# Altium project CP17E0276.PrjPcb
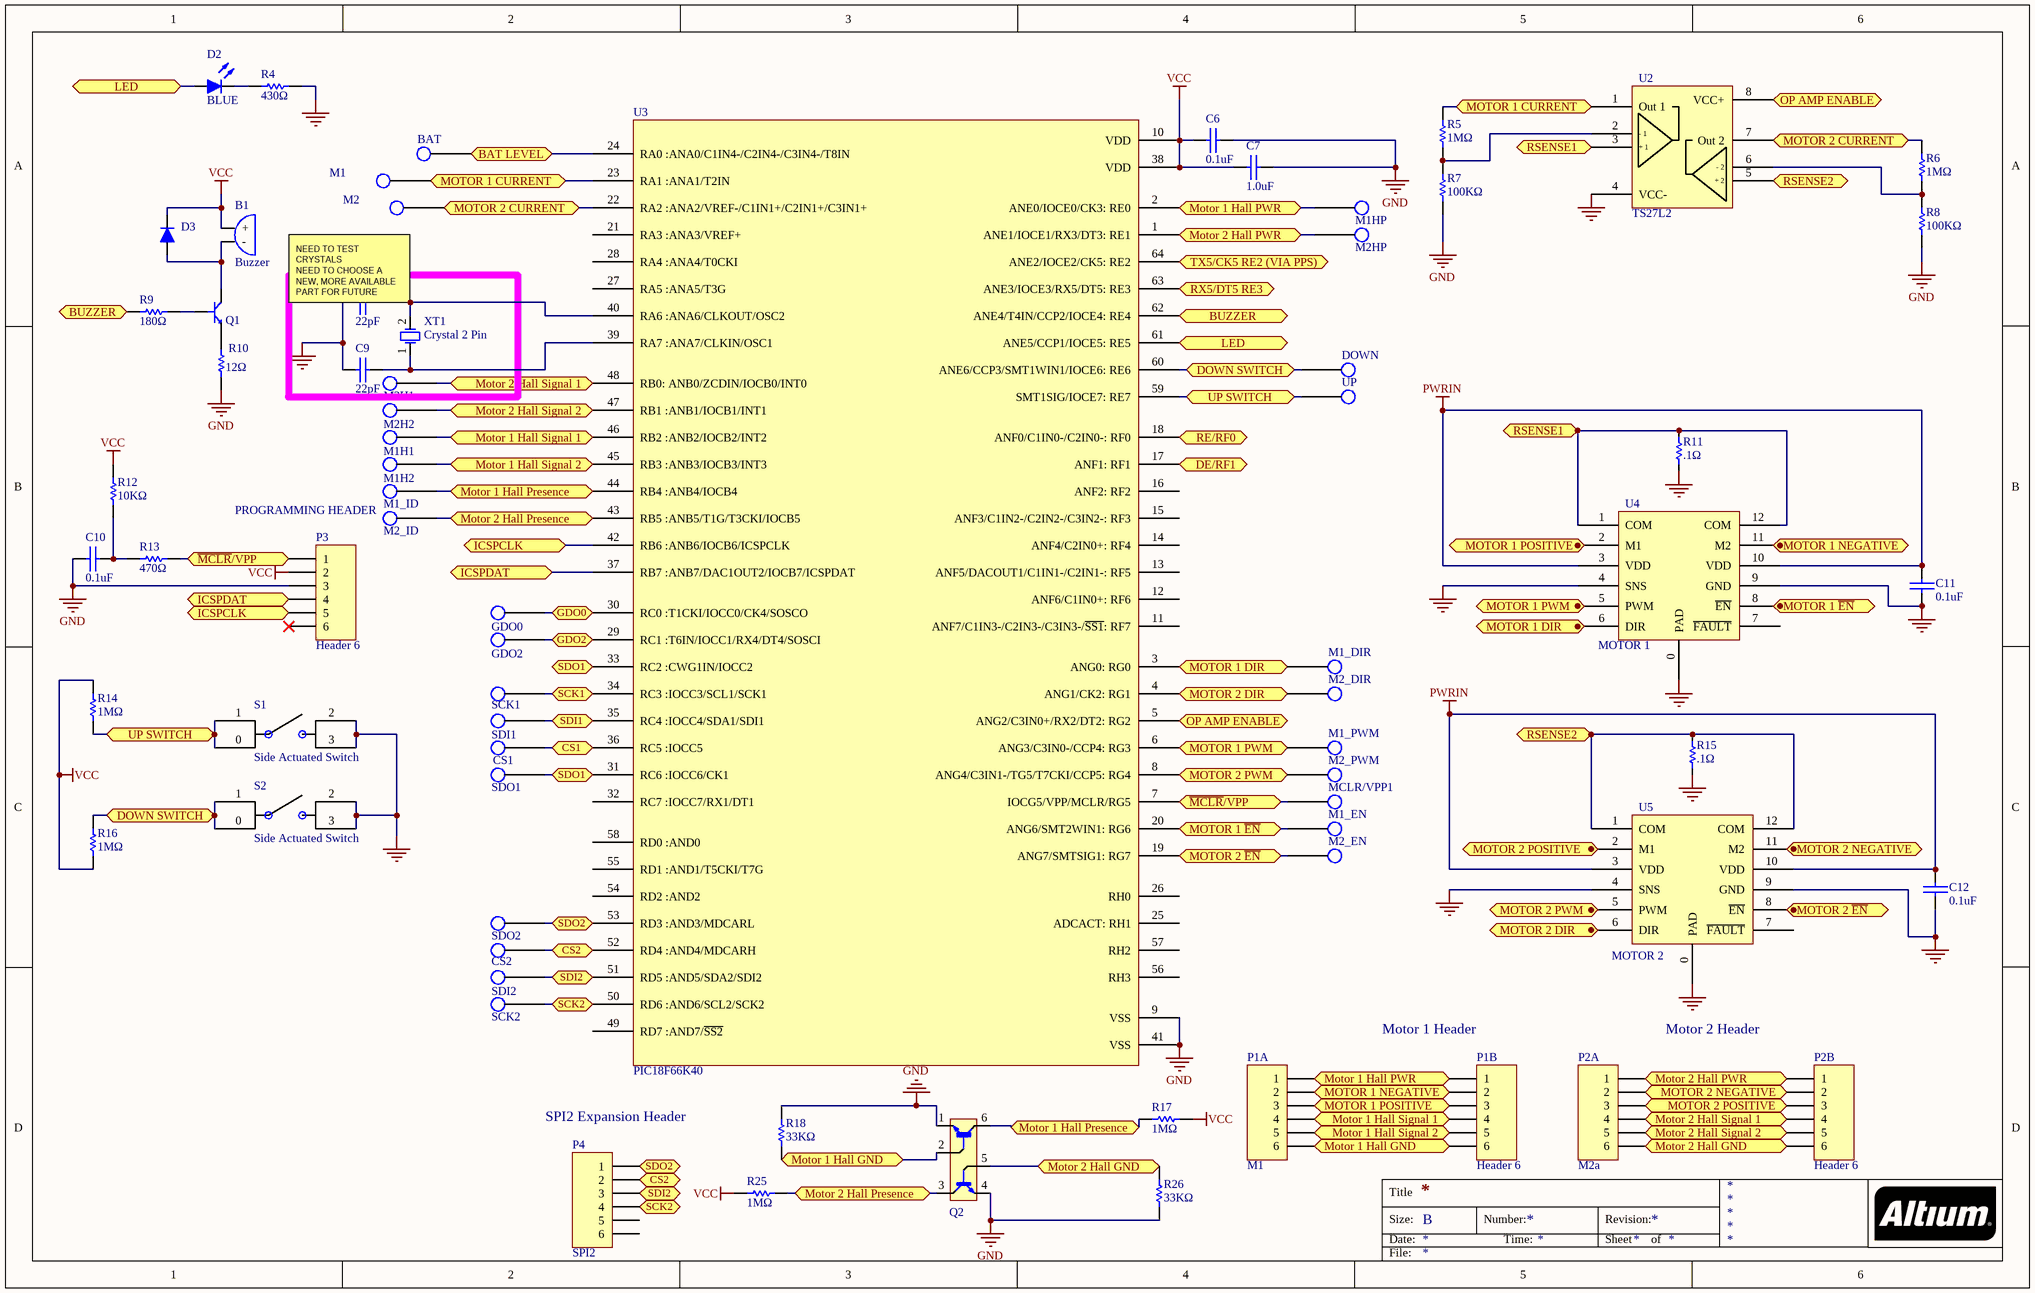
[diagram p0: Main.SchDoc]
4 sheets, 134 parts. Net scope: flat (ports and power ports of the same name join across sheets).
Board file: CP17E0276.PcbDoc
Sheets:
  Main.SchDoc
  Power.SchDoc
  Radio.SchDoc
  Buck Converter_12v.SchDoc

## Sheet Main.SchDoc
size B

### Parts
B1  Buzzer  [CST-931AP]  (no BOM)
BAT  (no value)  [TestPoint1]
C6  0.1uF  [0603 Small]
C7  1.0uF  [0603 Small]
C8  22pF  [0201]  (no BOM)
C9  22pF  [0201]  (no BOM)
C10  0.1uF  [0603 Small]
C11  0.1uF  [0603 Capacitor]
C12  0.1uF  [0603 Capacitor]
CS1  (no value)  [TestPoint1]
CS2  (no value)  [TestPoint1]
D2  BLUE  [0603 LED]
D3  (no value)  [SOD-323, SD-76]  (no BOM)
DOWN  (no value)  [TestPoint1]
GDO0  (no value)  [TestPoint1]
GDO2  (no value)  [TestPoint1]
M1  (no value)  [TestPoint1]
M1_DIR  (no value)  [TestPoint1]
M1_EN  (no value)  [TestPoint1]
M1_ID  (no value)  [TestPoint1]
M1_PWM  (no value)  [TestPoint1]
M1H1  (no value)  [TestPoint1]
M1H2  (no value)  [TestPoint1]
M1HP  (no value)  [TestPoint1]
M2  (no value)  [TestPoint1]
M2_DIR  (no value)  [TestPoint1]
M2_EN  (no value)  [TestPoint1]
M2_ID  (no value)  [TestPoint1]
M2_PWM  (no value)  [TestPoint1]
M2H1  (no value)  [TestPoint1]
M2H2  (no value)  [TestPoint1]
M2HP  (no value)  [TestPoint1]
MCLR/VPP1  (no value)  [TestPoint1]
P1A  M1  [2X3 Header (For track drapery)]
P1B  Header 6  [Track Edge Connector]
P2A  M2a  [2X3 Header (For track drapery)]
P2B  Header 6  [Track Edge Connector]
P3  Header 6  [Track Edge Connector]
P4  SPI2  [HDR2X2]
Q1  NPN  [SOT23 - duplicate]  (value not drawn)  (no BOM)
Q2  Dual BJT  [SOT-363]  (value not drawn)
R4  430Ω  [0603 Small]
R5  1MΩ  [0603 Resistor]
R6  1MΩ  [0603 Resistor]
R7  100KΩ  [0603 Resistor]
R8  100KΩ  [0603 Resistor]
R9  180Ω  [0402 Resistor]  (no BOM)
R10  12Ω  [6-0805_M]  (no BOM)
R11  .1Ω  [1206 Small]
R12  10KΩ  [0603 Small]
R13  470Ω  [0603 Small]
R14  1MΩ  [0603 Resistor]
R15  .1Ω  [1206 Small]
R16  1MΩ  [0603 Resistor]
R17  1MΩ  [0603 Resistor]
R18  33KΩ  [0603 Small]
R25  1MΩ  [0603 Resistor]
R26  33KΩ  [0603 Small]
S1  Side Actuated Switch  [HDP001L]
S2  Side Actuated Switch  [HDP001L]
SCK1  (no value)  [TestPoint1]
SCK2  (no value)  [TestPoint1]
SDI1  (no value)  [TestPoint1]
SDI2  (no value)  [TestPoint1]
SDO1  (no value)  [TestPoint1]
SDO2  (no value)  [TestPoint1]
U2  TS27L2  [SOIC-8]
U3  PIC18F66K40  [64TQFP]
U4  MOTOR 1  [TD1233]
U5  MOTOR 2  [TD1233]
UP  (no value)  [TestPoint1]
XT1  Crystal 2 Pin  [HC-49S]  (no BOM)

### Ports
BAT LEVEL (bidir), BUZZER (bidir), CS1 (bidir), CS2 (bidir), DE/RF1, DOWN SWITCH (bidir), GDO0 (bidir), GDO2 (bidir), ICSPCLK, ICSPDAT, LED (bidir), MOTOR 1 CURRENT, MOTOR 1 DIR, Motor 1 Hall GND, Motor 1 Hall Presence, Motor 1 Hall PWR, Motor 1 Hall Signal 1, Motor 1 Hall Signal 2, MOTOR 1 NEGATIVE, MOTOR 1 POSITIVE, MOTOR 1 PWM, MOTOR 1 ~{EN}, MOTOR 2 CURRENT, MOTOR 2 DIR, Motor 2 Hall GND, Motor 2 Hall Presence, Motor 2 Hall PWR, Motor 2 Hall Signal 1, Motor 2 Hall Signal 2, MOTOR 2 NEGATIVE, MOTOR 2 POSITIVE, MOTOR 2 PWM, MOTOR 2 ~{EN}, OP AMP ENABLE (bidir), RE/RF0, RSENSE1, RSENSE2, RX5/DT5 RE3, SCK1 (bidir), SCK2 (bidir), SDI1 (bidir), SDI2 (bidir), SDO1 (bidir), SDO2 (bidir), TX5/CK5 RE2 (VIA PPS), UP SWITCH (bidir), ~{MCLR}/VPP

### Nets
GND: C6.1 C7.1 C8.1 C9.1 C10.1 C11.1 C12.1 P3.3 Q2.1 Q2.4 R4.2 R7.2 R8.2 R10.1 R11.2 R15.2 R18.1 R26.2 S1.2 S1.3 S2.2 S2.3 U2.4(VCC-) U3.9(VSS) U3.41(VSS) U4.0(PAD) U4.4(SNS) U4.9(GND) U5.0(PAD) U5.4(SNS) U5.9(GND)
PWRIN: C11.2 C12.2 U4.3(VDD) U4.10(VDD) U5.3(VDD) U5.10(VDD)
VCC: B1.1(+) C6.2 C7.2 D3.2 P3.2 R12.2 R14.2 R16.1 R17.2 R25.1 U3.10(VDD) U3.38(VDD)
NetB1_2: B1.2(-) D3.1 Q1.1
NetBAT_0: BAT.0 U3.24(RA0_:ANA0/C1IN4-/C2IN4-/C3IN4-/T8IN) ; port BAT LEVEL
NetC8_2: C8.2 U3.40(RA6_:ANA6/CLKOUT/OSC2) XT1.2
NetC9_2: C9.2 U3.39(RA7_:ANA7/CLKIN/OSC1) XT1.1
NetC10_2: C10.2 R12.1 R13.2
NetCS1_0: CS1.0 U3.36(RC5_:IOCC5) ; port CS1
NetCS2_0: CS2.0 P4.2 U3.52(RD4_:AND4/MDCARH) ; port CS2
NetD2_1: D2.1(A) U3.61(ANE5/CCP1/IOCE5:_RE5) ; port LED
NetD2_2: D2.2(K) R4.1
NetDOWN_0: DOWN.0 R16.2 S2.0 S2.1 U3.60(ANE6/CCP3/SMT1WIN1/IOCE6:_RE6) ; port DOWN SWITCH
NetGDO0_0: GDO0.0 U3.30(RC0_:T1CKI/IOCC0/CK4/SOSCO) ; port GDO0
NetGDO2_0: GDO2.0 U3.29(RC1_:T6IN/IOCC1/RX4/DT4/SOSCI) ; port GDO2
NetM1_0: M1.0 R5.1 U2.1(Out_1) U3.23(RA1_:ANA1/T2IN) ; port MOTOR 1 CURRENT
NetM1_DIR_0: M1_DIR.0 U3.3(ANG0:_RG0) ; port MOTOR 1 DIR
NetM1_EN_0: M1_EN.0 U3.20(ANG6/SMT2WIN1:_RG6) ; port MOTOR 1 ~{EN}
NetM1_ID_0: M1_ID.0 Q2.6 R17.1 U3.44(RB4_:ANB4/IOCB4) ; port Motor 1 Hall Presence
NetM1_PWM_0: M1_PWM.0 U3.6(ANG3/C3IN0-/CCP4:_RG3) ; port MOTOR 1 PWM
NetM1H1_0: M1H1.0 P1A.4 P1B.4 U3.46(RB2_:ANB2/IOCB2/INT2) ; port Motor 1 Hall Signal 1
NetM1H2_0: M1H2.0 P1A.5 P1B.5 U3.45(RB3_:ANB3/IOCB3/INT3) ; port Motor 1 Hall Signal 2
NetM1HP_0: M1HP.0 P1A.1 P1B.1 U3.2(ANE0/IOCE0/CK3:_RE0) ; port Motor 1 Hall PWR
NetM2_0: M2.0 R6.1 U2.7(Out_2) U3.22(RA2_:ANA2/VREF-/C1IN1+/C2IN1+/C3IN1+) ; port MOTOR 2 CURRENT
NetM2_DIR_0: M2_DIR.0 U3.4(ANG1/CK2:_RG1) ; port MOTOR 2 DIR
NetM2_EN_0: M2_EN.0 U3.19(ANG7/SMTSIG1:_RG7) ; port MOTOR 2 ~{EN}
NetM2_ID_0: M2_ID.0 Q2.3 R25.2 U3.43(RB5_:ANB5/T1G/T3CKI/IOCB5) ; port Motor 2 Hall Presence
NetM2_PWM_0: M2_PWM.0 U3.8(ANG4/C3IN1-/TG5/T7CKI/CCP5:_RG4) ; port MOTOR 2 PWM
NetM2H1_0: M2H1.0 P2A.4 P2B.4 U3.48(RB0:_ANB0/ZCDIN/IOCB0/INT0) ; port Motor 2 Hall Signal 1
NetM2H2_0: M2H2.0 P2A.5 P2B.5 U3.47(RB1_:ANB1/IOCB1/INT1) ; port Motor 2 Hall Signal 2
NetM2HP_0: M2HP.0 P2A.1 P2B.1 U3.1(ANE1/IOCE1/RX3/DT3:_RE1) ; port Motor 2 Hall PWR
NetMCLR/VPP1_0: MCLR/VPP1.0 P3.1 R13.1 U3.7(IOCG5/VPP/MCLR/RG5) ; port ~{MCLR}/VPP
NetP1A_2: P1A.2 P1B.2 ; port MOTOR 1 NEGATIVE
NetP1A_3: P1A.3 P1B.3 ; port MOTOR 1 POSITIVE
NetP1A_6: P1A.6 P1B.6 Q2.2 R18.2 ; port Motor 1 Hall GND
NetP2A_2: P2A.2 P2B.2 ; port MOTOR 2 NEGATIVE
NetP2A_3: P2A.3 P2B.3 ; port MOTOR 2 POSITIVE
NetP2A_6: P2A.6 P2B.6 Q2.5 R26.1 ; port Motor 2 Hall GND
NetP3_4: P3.4 U3.37(RB7_:ANB7/DAC1OUT2/IOCB7/ICSPDAT) ; port ICSPDAT
NetP3_5: P3.5 U3.42(RB6_:ANB6/IOCB6/ICSPCLK) ; port ICSPCLK
NetP4_1: P4.1 SDO2.0 U3.53(RD3_:AND3/MDCARL) ; port SDO2
NetP4_3: P4.3 SDI2.0 U3.51(RD5_:AND5/SDA2/SDI2) ; port SDI2
NetP4_4: P4.4 SCK2.0 U3.50(RD6_:AND6/SCL2/SCK2) ; port SCK2
NetQ1_2: Q1.2 R10.2
NetQ1_3: Q1.3 R9.2
NetR5_2: R5.2 R7.1 U2.2(-_1)
NetR6_2: R6.2 R8.1 U2.6(-_2)
NetR9_1: R9.1 U3.62(ANE4/T4IN/CCP2/IOCE4:_RE4) ; port BUZZER
NetR11_1: R11.1 U2.3(+_1) U4.1(COM) U4.12(COM) ; port RSENSE1
NetR14_1: R14.1 S1.0 S1.1 U3.59(SMT1SIG/IOCE7:_RE7) UP.0 ; port UP SWITCH
NetR15_1: R15.1 U2.5(+_2) U5.1(COM) U5.12(COM) ; port RSENSE2
NetSCK1_0: SCK1.0 U3.34(RC3_:IOCC3/SCL1/SCK1) ; port SCK1
NetSDI1_0: SDI1.0 U3.35(RC4_:IOCC4/SDA1/SDI1) ; port SDI1
NetSDO1_0: SDO1.0 U3.31(RC6_:IOCC6/CK1) U3.33(RC2_:CWG1IN/IOCC2) ; port SDO1
NetU2_8: U2.8(VCC+) U3.5(ANG2/C3IN0+/RX2/DT2:_RG2) ; port OP AMP ENABLE
NetU3_17: U3.17(ANF1:_RF1) ; port DE/RF1
NetU3_18: U3.18(ANF0/C1IN0-/C2IN0-:_RF0) ; port RE/RF0
NetU3_63: U3.63(ANE3/IOCE3/RX5/DT5:_RE3) ; port RX5/DT5 RE3
NetU3_64: U3.64(ANE2/IOCE2/CK5:_RE2) ; port TX5/CK5 RE2 (VIA PPS)

Not connected (* = marked no-connect by the designer): P3 6*; P4 5 6; U3 11(ANF7/C1IN3-/C2IN3-/C3IN3-/~{SS1}:_RF7) 12(ANF6/C1IN0+:_RF6) 13(ANF5/DACOUT1/C1IN1-/C2IN1-:_RF5) 14(ANF4/C2IN0+:_RF4) 15(ANF3/C1IN2-/C2IN2-/C3IN2-:_RF3) 16(ANF2:_RF2) 21(RA3_:ANA3/VREF+) 25(ADCACT:_RH1) 26(RH0) 27(RA5_:ANA5/T3G) 28(RA4_:ANA4/T0CKI) 32(RC7_:IOCC7/RX1/DT1) 49(RD7_:AND7/~{SS2}) 54(RD2_:AND2) 55(RD1_:AND1/T5CKI/T7G) 56(RH3) 57(RH2) 58(RD0_:AND0); U4 2(M1) 5(PWM) 6(DIR) 7(~{FAULT}) 8(~{EN}) 11(M2); U5 2(M1) 5(PWM) 6(DIR) 7(~{FAULT}) 8(~{EN}) 11(M2)

### Notes on the sheet
- (near C8) NEED TO TEST CRYSTALS
  NEED TO CHOOSE A NEW, MORE AVAILABLE PART FOR FUTURE ORDERS
- PROGRAMMING HEADER
- (near P1B) Motor 1 Header
- Motor 2 Header
- SPI2 Expansion Header
- Title
- Size:
- Date:
- B
- Number:
- Time:
- Revision:
- Sheet
- of
- File:

### Library data of the parts
B1 = Buzzer: AUDIO MAGNETIC XDCR 2-4V TH; Manufacturer: CUI Inc.; Cost: 0.62; Manufacturer#: CST-931AP
BAT CS1 CS2 DOWN GDO0 GDO2 M1 M1_DIR M1_EN M1_ID M1_PWM M1H1 M1H2 M1HP M2 M2_DIR M2_EN M2_ID M2_PWM M2H1 M2H2 M2HP MCLR/VPP1 SCK1 SCK2 SDI1 SDI2 SDO1 SDO2 UP = TEST POINT
C6 C10 = CAP: CAP CER 0.1UF 50V 10% X7R 0603; Manufacturer: Murata Electronics; Manufacturer#: GRM188R71H104KA93J; Cost: 0.022
C7 = CAP: CAP CER 1UF 50V 10% X5R 0603; Manufacturer: TAIYO YUDEN; Manufacturer#: UMK107BJ105KA-T; Cost: 0.0303
C8 C9 = CAP: CAP CER 22PF 50V NP0 0201; Manufacturer: Murata Electronics; Manufacturer#: GRM0335C1H220JA01D; Cost: .00182
C11 C12 = CAP: MLCC - SMD/SMT 0603 0.1uF 50volts X7R 10%; Manufacturer: Murata Electronics; Manufacturer#: GCM188R71H104KA57D; Cost: 0.018
D2 = LED2: LED BLUE DIFFUSED 0603 SMD; Manufacturer: OSRAM Opto Semiconductors Inc.; Manufacturer#: LB Q39G-L2OO-35-1; Cost: 0.08349
D3 = Diode: Diode Small Signal Switching 100V 0.25A 2-Pin SOD-323 T/R; Manufacturer: Vishay Semiconductors; Manufacturer#: BAS16WS-E3-08; Cost: 0.03
P1A P1B P2A P2B P3 P4 = Header 6: Header, 6-Pin
  P1A P2A: LatestRevisionDate: 17-Jul-2002; LatestRevisionNote: Re-released for DXP Platform.; Publisher: Altium Limited
Q1 = NPN: Trans GP BJT NPN 40V 0.6A 3-Pin SOT-23 T/R; Manufacturer: MCC; Manufacturer#: 833MMBT2222A-TP; Cost: 0.028
Q2 = Dual BJT: BJT COMPOSITE TRANSISTOR GL WNG 2.9x2.8mm; Manufacturer: ON Semiconductor; Manufacturer#: MBT2222ADW1T1G; Cost: 0.05146
R4 = Res1: Thick Film Resistors - SMD 1/10watt 430ohms 1%; Manufacturer: Vishay Semiconductors; Manufacturer#: CRCW0603430RFKEA; Cost: 0.018
R5 R6 R14 R16 R17 R25 = Res1: RES SMD 1M OHM 5% 1/10W 0603; Manufacturer: Yageo; Manufacturer#: RC0603JR-071ML; Cost: .00198
R7 R8 = Res1: RES SMD 100K OHM 5% 1/10W 0603; Manufacturer: Yageo; Manufacturer#: RC0603JR-07100KL; Cost: 0.00198
R9 = Res1: RES SMD 180 OHM 1% 1/10W 0402; Manufacturer: Panasonic; Manufacturer#: ERJ-2RKF1800X; Cost: 0.005
R10 = Res1: RES SMD 12 OHM 5% 1/2W 0805; Manufacturer: Panasonic Electronic Components; Manufacturer#: ERJ-P06J120V; Cost: .06318
R11 R15 = Resistor: RES SMD 0.1 OHM 1% 1W 1206; Manufacturer: Samsung Electro-Mechanics America, Inc.; Manufacturer#: RUW3216FR100CS; Cost: .05544
R12 R13 = Res1: Thick Film Resistors - SMD 0603 10Kohms 1% Tol; Manufacturer: Panasonic; Manufacturer#: ERJ-3EKF1002V; Cost: 0.002
R18 R26 = Res1: Thick Film Resistors - SMD 0603 10Kohms 1% Tol; Manufacturer: Yageo; Manufacturer#: RC0402FR-0733KL; Cost: 0.00242
S1 S2 = Side Actuated Switch: SWITCH DETECTOR SPST-NO 1MA 5V; Manufacturer: C&K Components; Manufacturer#: HDP001L; Cost: 0.26257
U2 = TS27L2: OP AMP - 2 CHANNEL; Manufacturer: STMicroelectronics; Manufacturer#: TS27L2CDT; Cost: .1842
U3 = PIC18F66K40: IC MCU 8BIT 64KB FLASH 64TQFP; Manufacturer: Microchip Technology; Manufacturer#: PIC18F66K40T-I/PT; Cost: 1.9158
U4 U5 = MAX14870: IC MOTOR DVR DC FULL BR 12TDFN; Manufacturer: Maxim Integrated; Manufacturer#: MAX14870ETC+T; Cost: 1.6157
XT1 = Crystal 2 Pin: Design Item Id: CRYS-25MHz-QC49

## Sheet Power.SchDoc
size B
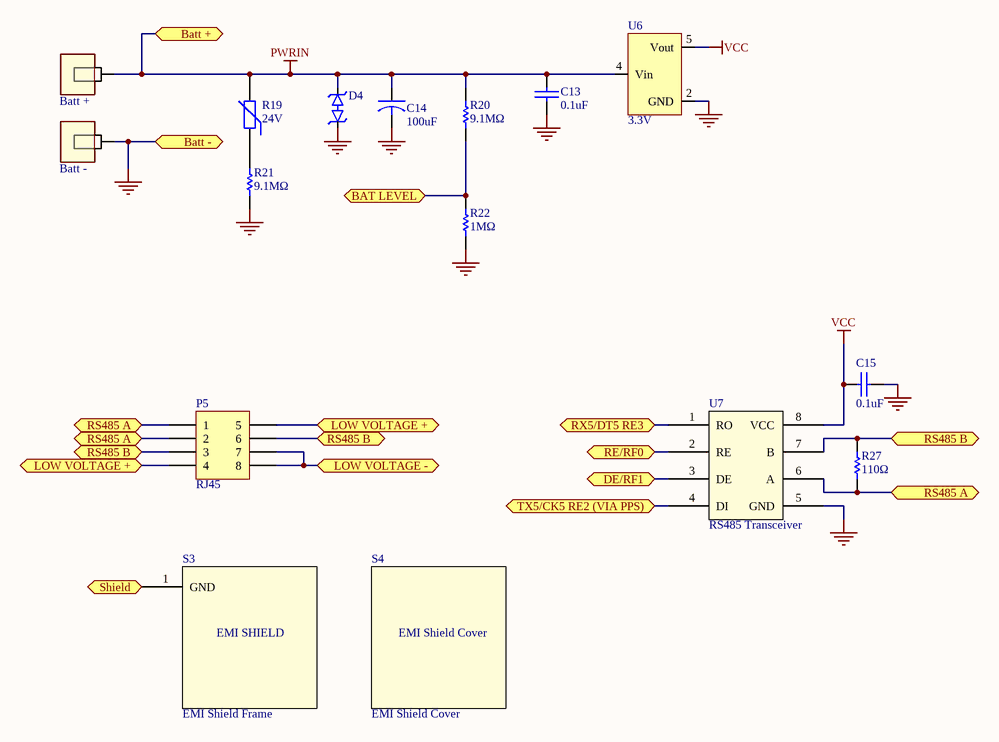
[diagram p1: Power.SchDoc]

### Parts
B+1  Batt +  [45 mil hole]
B-1  Batt -  [45 mil hole]
C13  0.1uF  [0603 Small]
C14  100uF  [ALEL_D8]
C15  0.1uF  [0603 Small]
D4  SMAJ20  [sma+]  (value not drawn)
P5  RJ45  [RJ45 Modular Connector 8p8c]
R19  24V  [0603 Small]
R20  9.1MΩ  [0603 Resistor]
R21  9.1MΩ  [0603 Resistor]
R22  1MΩ  [0603 Resistor]
R27  110Ω  [0603 Resistor]
S3  EMI Shield Frame  [SMS-1020]
S4  EMI Shield Cover
U6  3.3V  [SC70_5]
U7  RS485 Transceiver  [SOIC-8]

### Ports
BAT LEVEL (bidir), Batt +, Batt -, DE/RF1, LOW VOLTAGE +, LOW VOLTAGE -, RE/RF0, RS485 A, RS485 B, RX5/DT5 RE3, Shield, TX5/CK5 RE2 (VIA PPS)

### Nets
GND: B-1.1 C13.2 C14.2 C15.1 D4.1 R21.2 R22.2 U6.2(GND) U7.5(GND) ; port Batt -
PWRIN: B+1.1 C13.1 C14.1 D4.2 R19.2 R20.1 U6.4(Vin) ; port Batt +
VCC: C15.2 U6.5(Vout) U7.8(VCC)
NetBAT_0: R20.2 R22.1 ; port BAT LEVEL
NetC1_2: P5.7 P5.8 S3.1(GND) ; port LOW VOLTAGE -, port Shield
NetC38_1: P5.4 P5.5 ; port LOW VOLTAGE +
NetP5_1: P5.1 P5.2 R27.2 U7.6(A) ; port RS485 A
NetP5_3: P5.3 P5.6 R27.1 U7.7(B) ; port RS485 B
NetR19_1: R19.1 R21.1
NetU3_17: U7.3(DE) ; port DE/RF1
NetU3_18: U7.2(RE) ; port RE/RF0
NetU3_63: U7.1(RO) ; port RX5/DT5 RE3
NetU3_64: U7.4(DI) ; port TX5/CK5 RE2 (VIA PPS)

### Notes on the sheet
- Title
- Size:
- Date:
- B
- Number:
- Time:
- Revision:
- Sheet
- of
- File:

### Library data of the parts
B+1 = Motor+Term: 7055 Series, Two Inches in length
B-1 = Motor-Term: 7055 Series, Two Inches in length; Manufacturer: Alpha Wire; Manufacturer#: 7055 BK005; Cost: 0.125
C13 C15 = CAP: CAP CER 0.1UF 50V 10% X7R 0603; Manufacturer#: GRM188R71H104KA93J; Manufacturer: Murata Electronics; Cost: 0.022
C14 = CAPACITOR: CAP ALUM 100UF 35V 20% SMD; Manufacturer: PANASONIC - ECG; Manufacturer#: EEE-1VA101XP; Cost: 0.1202
D4 = TVS Diode: TVS 20V 400 Watts; Manufacturer: MCC; Manufacturer#: SMAJ20CA-TP; Cost: 0.104
P5 = Header 4X2A: Header, 4-Pin, Dual row; Manufacturer: Stewart Connector; Manufacturer#: SS-60000-010; Cost: 1.2315
R19 = Res Varistor: Varistor (Voltage-Sensitive Resistor); Manufacturer: Bourns Inc.; Manufacturer#: CG0603MLC-24LE; Cost: .11124
R20 R21 = Res1: RES SMD 9.1M OHM 5% 1/10W 0603; Manufacturer: Yageo; Manufacturer#: RC0603JR-079M1L; Cost: .00187
R22 = Res1: as R5 on sheet Main; Cost: .00198
R27 = Res1: RES SMD 110 OHM 5% 1/10W 0603; Manufacturer: Yageo; Manufacturer#: RC0603JR-07110RL; Cost: 0.00207
S3 = BMI-S-101 EMI Shield: EMI SHIELD; Manufacturer: LEADER TECH; Manufacturer#: SMS-1020F; Cost: 0.59
S4 = EMI Shield Cover: SMS Cover; Manufacturer: LEADER TECH; Manufacturer#: SMS-1020C; Cost: 0.18
U6 = LMV1703T: LDO Voltage Regulators 50mA 3.3V HI LDO; Manufacturer: Texas Instruments; Manufacturer#: TPS71533DCKR; Vendor: Arrow; Cost: 0.3076
U7 = ST3485ECDR Transceiver Half RS422,RS485: Single Transmitter/Receiver RS-422/RS-485 8-Pin SO N T/R; Manufacturer: STMicroelectronics; Manufacturer#: ST3485ECDR; Cost: 0.67053

## Sheet Radio.SchDoc
size B
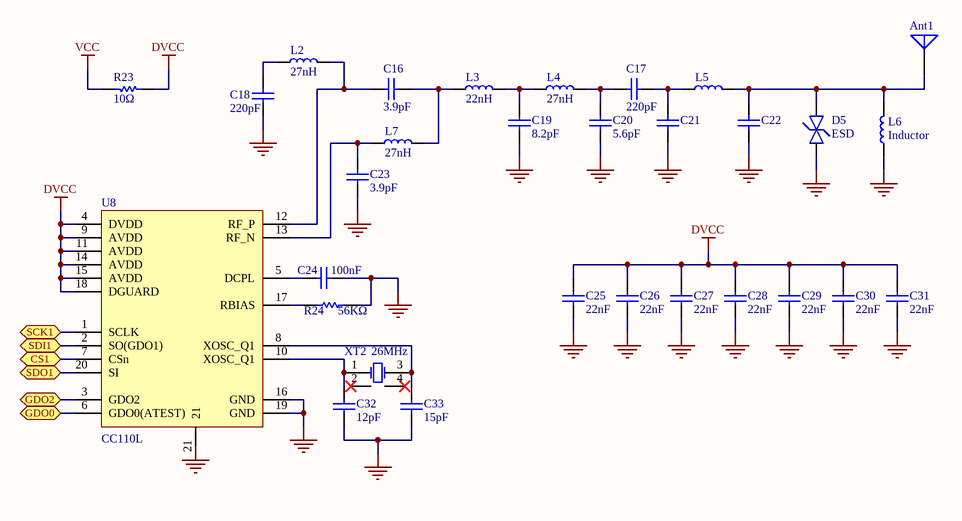
[diagram p2: Radio.SchDoc]

### Parts
Ant1  Antenna  [35 mil hole]  (value not drawn)
C16  3.9pF  [0402 Small]
C17  220pF  [0402 Small]
C18  220pF  [0402 Small]
C19  8.2pF  [0402 Small]
C20  5.6pF  [0402 Small]
C21  NP  [0402 Small]  (value not drawn)
C22  NP  [0402 Small]  (value not drawn)
C23  3.9pF  [0402 Small]
C24  100nF  [0402 Small]
C25  22nF  [0402 Small]
C26  22nF  [0402 Small]
C27  22nF  [0402 Small]
C28  22nF  [0402 Small]
C29  22nF  [0402 Small]
C30  22nF  [0402 Small]
C31  22nF  [0402 Small]
C32  12pF  [0402 Small]
C33  15pF  [0402 Small]
D5  ESD  [XDFN2]
L2  27nH  [0402 Small]
L3  22nH  [0402 Small]
L4  27nH  [0402 Small]
L5  NP  [0402 Small]  (value not drawn)
L6  Inductor  [0402 Small]
L7  27nH  [0402 Small]
R23  10Ω  [0603 Small]
R24  56KΩ  [0402 Small]
U8  CC110L  [VQFN-20]
XT2  26MHz  [CFPX-5]

### Ports
CS1 (bidir), GDO0 (bidir), GDO2 (bidir), SCK1 (bidir), SDI1 (bidir), SDO1 (bidir)

### Nets
DVCC: C25.2 C26.2 C27.2 C28.2 C29.2 C30.2 C31.2 R23.2 U8.4(DVDD) U8.9(AVDD) U8.11(AVDD) U8.14(AVDD) U8.15(AVDD) U8.18(DGUARD)
GND: C18.1 C19.2 C20.2 C21.2 C22.2 C23.2 C24.1 C25.1 C26.1 C27.1 C28.1 C29.1 C30.1 C31.1 C32.1 C33.1 D5.1 L6.1 R24.2 U8.16(GND) U8.19(GND) U8.21
VCC: R23.1
NetAnt1_1: Ant1.1(A) C22.1 D5.2 L5.2 L6.2
NetC16_1: C16.1 L3.1 L7.2
NetC16_2: C16.2 L2.2 U8.12(RF_P)
NetC17_1: C17.1 C20.1 L4.2
NetC17_2: C17.2 C21.1 L5.1
NetC18_2: C18.2 L2.1
NetC19_1: C19.1 L3.2 L4.1
NetC23_1: C23.1 L7.1 U8.13(RF_N)
NetC24_2: C24.2 U8.5(DCPL)
NetC32_2: C32.2 U8.10(XOSC_Q1) XT2.1(OSC1)
NetC33_2: C33.2 U8.8(XOSC_Q1) XT2.3
NetCS1_0: U8.7(CSn) ; port CS1
NetGDO0_0: U8.6(GDO0(ATEST)) ; port GDO0
NetGDO2_0: U8.3(GDO2) ; port GDO2
NetR24_1: R24.1 U8.17(RBIAS)
NetSCK1_0: U8.1(SCLK) ; port SCK1
NetSDI1_0: U8.2(SO(GDO1)) ; port SDI1
NetSDO1_0: U8.20(SI) ; port SDO1

Not connected (* = marked no-connect by the designer): XT2 2(OSC2)* 4*

### Notes on the sheet
- Title
- Size:
- Date:
- B
- Number:
- Time:
- Revision:
- Sheet
- of
- File:

### Library data of the parts
Ant1 = Antenna: 6.8" Whip Antenna; Manufacturer: Alpha Wire; Manufacturer#: 422607 YL005; Cost: .18615; Length: 6.8
C16 C23 = Cap: Capacitor, 3.9p, 0402, NP0, +-0.25pF, 50V; Manufacturer: MURATA ELECTRONICS; Manufacturer#: GRM1555C1H3R9CA01D; Cost: 0.0069
C17 C18 = Cap: Capacitor, 220p, 0402, NP0, 5%, 50V; Manufacturer: MURATA ELECTRONICS; Manufacturer#: GRM1555C1H221JA01D; Cost: 0.0078
C19 = Cap: Capacitor, 8.2p, 0402, NP0, +-0.25pF, 50V; Manufacturer: MURATA ELECTRONICS; Manufacturer#: GRM1555C1H8R2CA01D; Cost: 0.0069
C20 = Cap: Capacitor, 5.6p, 0402, NP0, +-0.25pF, 50V; Manufacturer: MURATA ELECTRONICS; Manufacturer#: GRM1555C1H5R6CA01D; Cost: 0.0069
C21 C22 = Cap: Cost: 0
C24 = Cap: Capacitor, 100n, 0402, X5R, 10%, 10V; Manufacturer: MURATA ELECTRONICS; Manufacturer#: GRM155R71A104KA01D; Cost: 0.0066
C25-C31 = Cap: Capacitor, 22n, 0402, X7R, 10%, 25V; Manufacturer: MURATA ELECTRONICS; Manufacturer#: GRM155R71E223KA61J; Cost: 0.0100
C32 = Cap: CAP CER 12PF 50V 5% NP0 0402; Manufacturer: MURATA ELECTRONICS; Manufacturer#: GRM1555C1H120JA01D; Cost: 0.0042
C33 = Cap: CAP CER 15PF 50V 5% NP0 0402; Manufacturer: MURATA ELECTRONICS; Manufacturer#: GRM1555C1H150JA01D; Cost: 0.00525
D5 = BiDi: TVS DIODE 16VWM 39VC 2XDFN; Manufacturer: ON Semiconductor; Manufacturer#: SZESD7461N2T5G; Cost: 0.15743
L2 L4 L7 = Inductor: Inductor, 27n, 0402, ±5%; Manufacturer: MURATA ELECTRONICS; Manufacturer#: LQG15HS27NJ02D; Cost: 0.0304
L3 = Inductor: Inductor, 22n, 0402, ±5%; Manufacturer: MURATA ELECTRONICS; Manufacturer#: LQG15HS22NJ02D; Cost: 0.0304
L5 = Inductor: Cost: 0
L6 = Inductor: Fixed Inductors 0.68uH; Manufacturer: TDK; Manufacturer#: MLF1005LR68K; Cost: 0.126
R23 = Res1: Thick Film Resistors - SMD 1/10watt 10ohms 1%; Manufacturer: Vishay Semiconductors; Manufacturer#: CRCW060310R0FKEB; Cost: 0.080
R24 = Res1: Resistor, 56k ohms, 0402,  ±1%; Manufacturer: Koa; Manufacturer#: RK73H1ETTP5602F; Cost: 0.003
U8 = CC1101: IC RF VALUE LINE TXRX 20QFN; Manufacturer: Texas Instruments; Manufacturer#: CC110LRGP; Cost: 1.8488
XT2 = CRYS: CRYSTAL 26MHZ 10PF SMD; Manufacturer: Suntsu; Manufacturer#: SCX572-26000MHZ; Cost: 0.3696

## Sheet Buck Converter_12v.SchDoc
size A
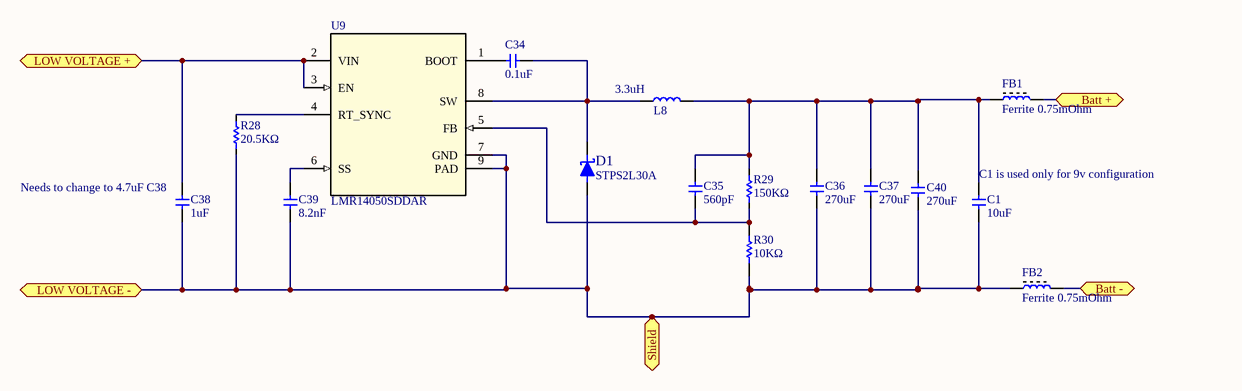
[diagram p3: Buck Converter_12v.SchDoc]

### Parts
C1  10uF  [0805 capacitor]
C34  0.1uF  [0805 capacitor]
C35  560pF  [0603 Capacitor]
C36  270uF  [APXG160ARA271MH70G]
C37  270uF  [APXG160ARA271MH70G]
C38  1uF  [1206 - duplicate]
C39  8.2nF  [0402 Small]
C40  270uF  [APXG160ARA271MH70G]
D1  STPS2L30A  [SMC]
FB1  Ferrite 0.75mOhm  [2-SMD, J-LEAD]
FB2  Ferrite 0.75mOhm  [2-SMD, J-LEAD]
L8  3.3uH  [SRN8040 - Power Inductor]
R28  20.5KΩ  [0603]
R29  150KΩ  [0603 resistor]
R30  10KΩ  [0805]
U9  LMR14050SDDAR  [SO8 - GROUND PAD]

### Ports
Batt +, Batt -, LOW VOLTAGE +, LOW VOLTAGE -, Shield

### Nets
GND: FB2.2 ; port Batt -
PWRIN: FB1.2 ; port Batt +
NetC1_1: C1.1 C35.1 C36.1 C37.1 C40.1 FB1.1 L8.2 R29.2
NetC1_2: C1.2 C36.2 C37.2 C38.2 C39.2 C40.2 D1.1(A) FB2.1 R28.1 R30.1 U9.7(GND) U9.9(PAD) ; port LOW VOLTAGE -, port Shield
NetC34_1: C34.1 D1.2(K) L8.1 U9.8(SW)
NetC34_2: C34.2 U9.1(BOOT)
NetC35_2: C35.2 R29.1 R30.2 U9.5(FB)
NetC38_1: C38.1 U9.2(VIN) U9.3(EN) ; port LOW VOLTAGE +
NetC39_1: C39.1 U9.6(SS)
NetR28_2: R28.2 U9.4(RT_SYNC)

### Notes on the sheet
- (near C38) Needs to change to 4.7uF C38
- (near C1) C1 is used only for 9v configuration

### Library data of the parts
C1 = Cap: 10µF ±10% 16V Ceramic Capacitor X5R 0805 (2012 Metric); Manufacturer: Murata Electronics North America; Manufacturer#: GRM21BR61C106KE15L; Cost: .03964
C34 = Cap: CAP CER 0.1UF 50V 10% X7R 0603; Manufacturer: KEMET; Manufacturer#: C0805C104K5RACTU; Cost: 0.0033
C35 = Cap: CAP CER 560PF 25V X7R 0201; Manufacturer: Murata Electronics North America; Manufacturer#: GRM033R71E561KA01D; Cost: 0.0015
C36 C37 C40 = Cap: CAP ALUM POLY 270UF 20% 16V SMD; Manufacturer: United Chemi-Con; Cost: 0.37433; Manufacturer#: APXG160ARA271MH70G
C38 = Cap: 1µF ±10% 50V Ceramic Capacitor X7R 0805 (2012 Metric); Manufacturer: Samsung Electro-Mechanics America, Inc.; Manufacturer#: CL21B105KBFNNNE; Cost: 0.04379
C39 = Cap: 8200pF ±10% 16V Ceramic Capacitor X7R 0402 (1005 Metric); Manufacturer: Murata Electronics North America; Manufacturer#: GRM155R71C822KA01D; Cost: 0.0052
D1 = DIODE_SCHOTTKY: DIODE SCHOTTKY 30V 2A SMA; Manufacturer#: B540C-13-F; Manufacturer: STMICROELECTRONICS; Cost: 0.1299
FB1 FB2 = Ferrite Bead: FERRITE BEAD 48 OHM 2SMD 1LN; Manufacturer: Laird-Signal Integrity Products; Manufacturer#: 28F0121-0SR-10; Cost: 0.06261
L8 = Inductor: Fixed Inductors XAL5030 High Current 3.3 uH 20 % 8.1 A; Manufacturer#: XAL5030-332MEB; Manufacturer: Coilcraft; Cost: 0.56
R28 = Resistor: 20.5k Ohm ±1% 0.1W, 1/10W Chip Resistor 0603 (1608 Metric) Automotive AEC-Q200 Thick Film; Manufacturer: Panasonic Electronic Components; Manufacturer#: ERJ-3EKF2052V; Cost: 0.0176
R29 = Resistor: RES SMD 150K OHM 1% 1/16W 0402; Manufacturer: Vishay Dale; Manufacturer#: CRCW0402150KFKED; Cost: 0.00670
R30 = Res1: RES SMD 10K OHM 1% 1/8W 0805; Manufacturer: Panasonic Electronic Components; Manufacturer#: ERJ-6ENF1002V; Cost: 0.00749
U9 = LMR14050SDDAR: Buck Switching Regulator IC Positive Adjustable 0.8V 1 Output 5A 8-PowerSOIC (0.154", 3.90mm Width); Manufacturer: Texas Instruments; PIN_COUNT: 9; Application_BuildNumber: *; PartNumber: LMR14050SDDAR; PackageReference: DDA0008E; MountType: SMT; CompType: IC; RoHS: Y; RefDes: RefDes; Type: DEV; Value: Value; Manufacturer_Part_Number: LMR14050SDDAR; Manufacturer_Name: Texas Instruments; Alternate_PartNumber: LMR14050SDDA; Manufacturer#: LMR14050SDDA; Cost: 2.9484

## Nets that join several sheets
GND: Main (31 pins), Power (9 pins), Radio (22 pins), Buck Converter_12v (FB2.2)
PWRIN: Main (6 pins), Power (7 pins), Buck Converter_12v (FB1.2)
VCC: Main (12 pins), Power (C15.2 U6.5 U7.8), Radio (R23.1)
NetBAT_0: Main (BAT.0 U3.24), Power (R20.2 R22.1)
NetC1_2: Power (P5.7 P5.8 S3.1), Buck Converter_12v (12 pins)
NetC38_1: Power (P5.4 P5.5), Buck Converter_12v (C38.1 U9.2 U9.3)
NetCS1_0: Main (CS1.0 U3.36), Radio (U8.7)
NetGDO0_0: Main (GDO0.0 U3.30), Radio (U8.6)
NetGDO2_0: Main (GDO2.0 U3.29), Radio (U8.3)
NetSCK1_0: Main (SCK1.0 U3.34), Radio (U8.1)
NetSDI1_0: Main (SDI1.0 U3.35), Radio (U8.2)
NetSDO1_0: Main (SDO1.0 U3.31 U3.33), Radio (U8.20)
NetU3_17: Main (U3.17), Power (U7.3)
NetU3_18: Main (U3.18), Power (U7.2)
NetU3_63: Main (U3.63), Power (U7.1)
NetU3_64: Main (U3.64), Power (U7.4)

## Assembly variants
CP17E0276_9: not fitted C36 C37 C40
CP17E0276_12: not fitted C1